# EAGLE design Sensact v4.2 (EAGLE 8.2.1)
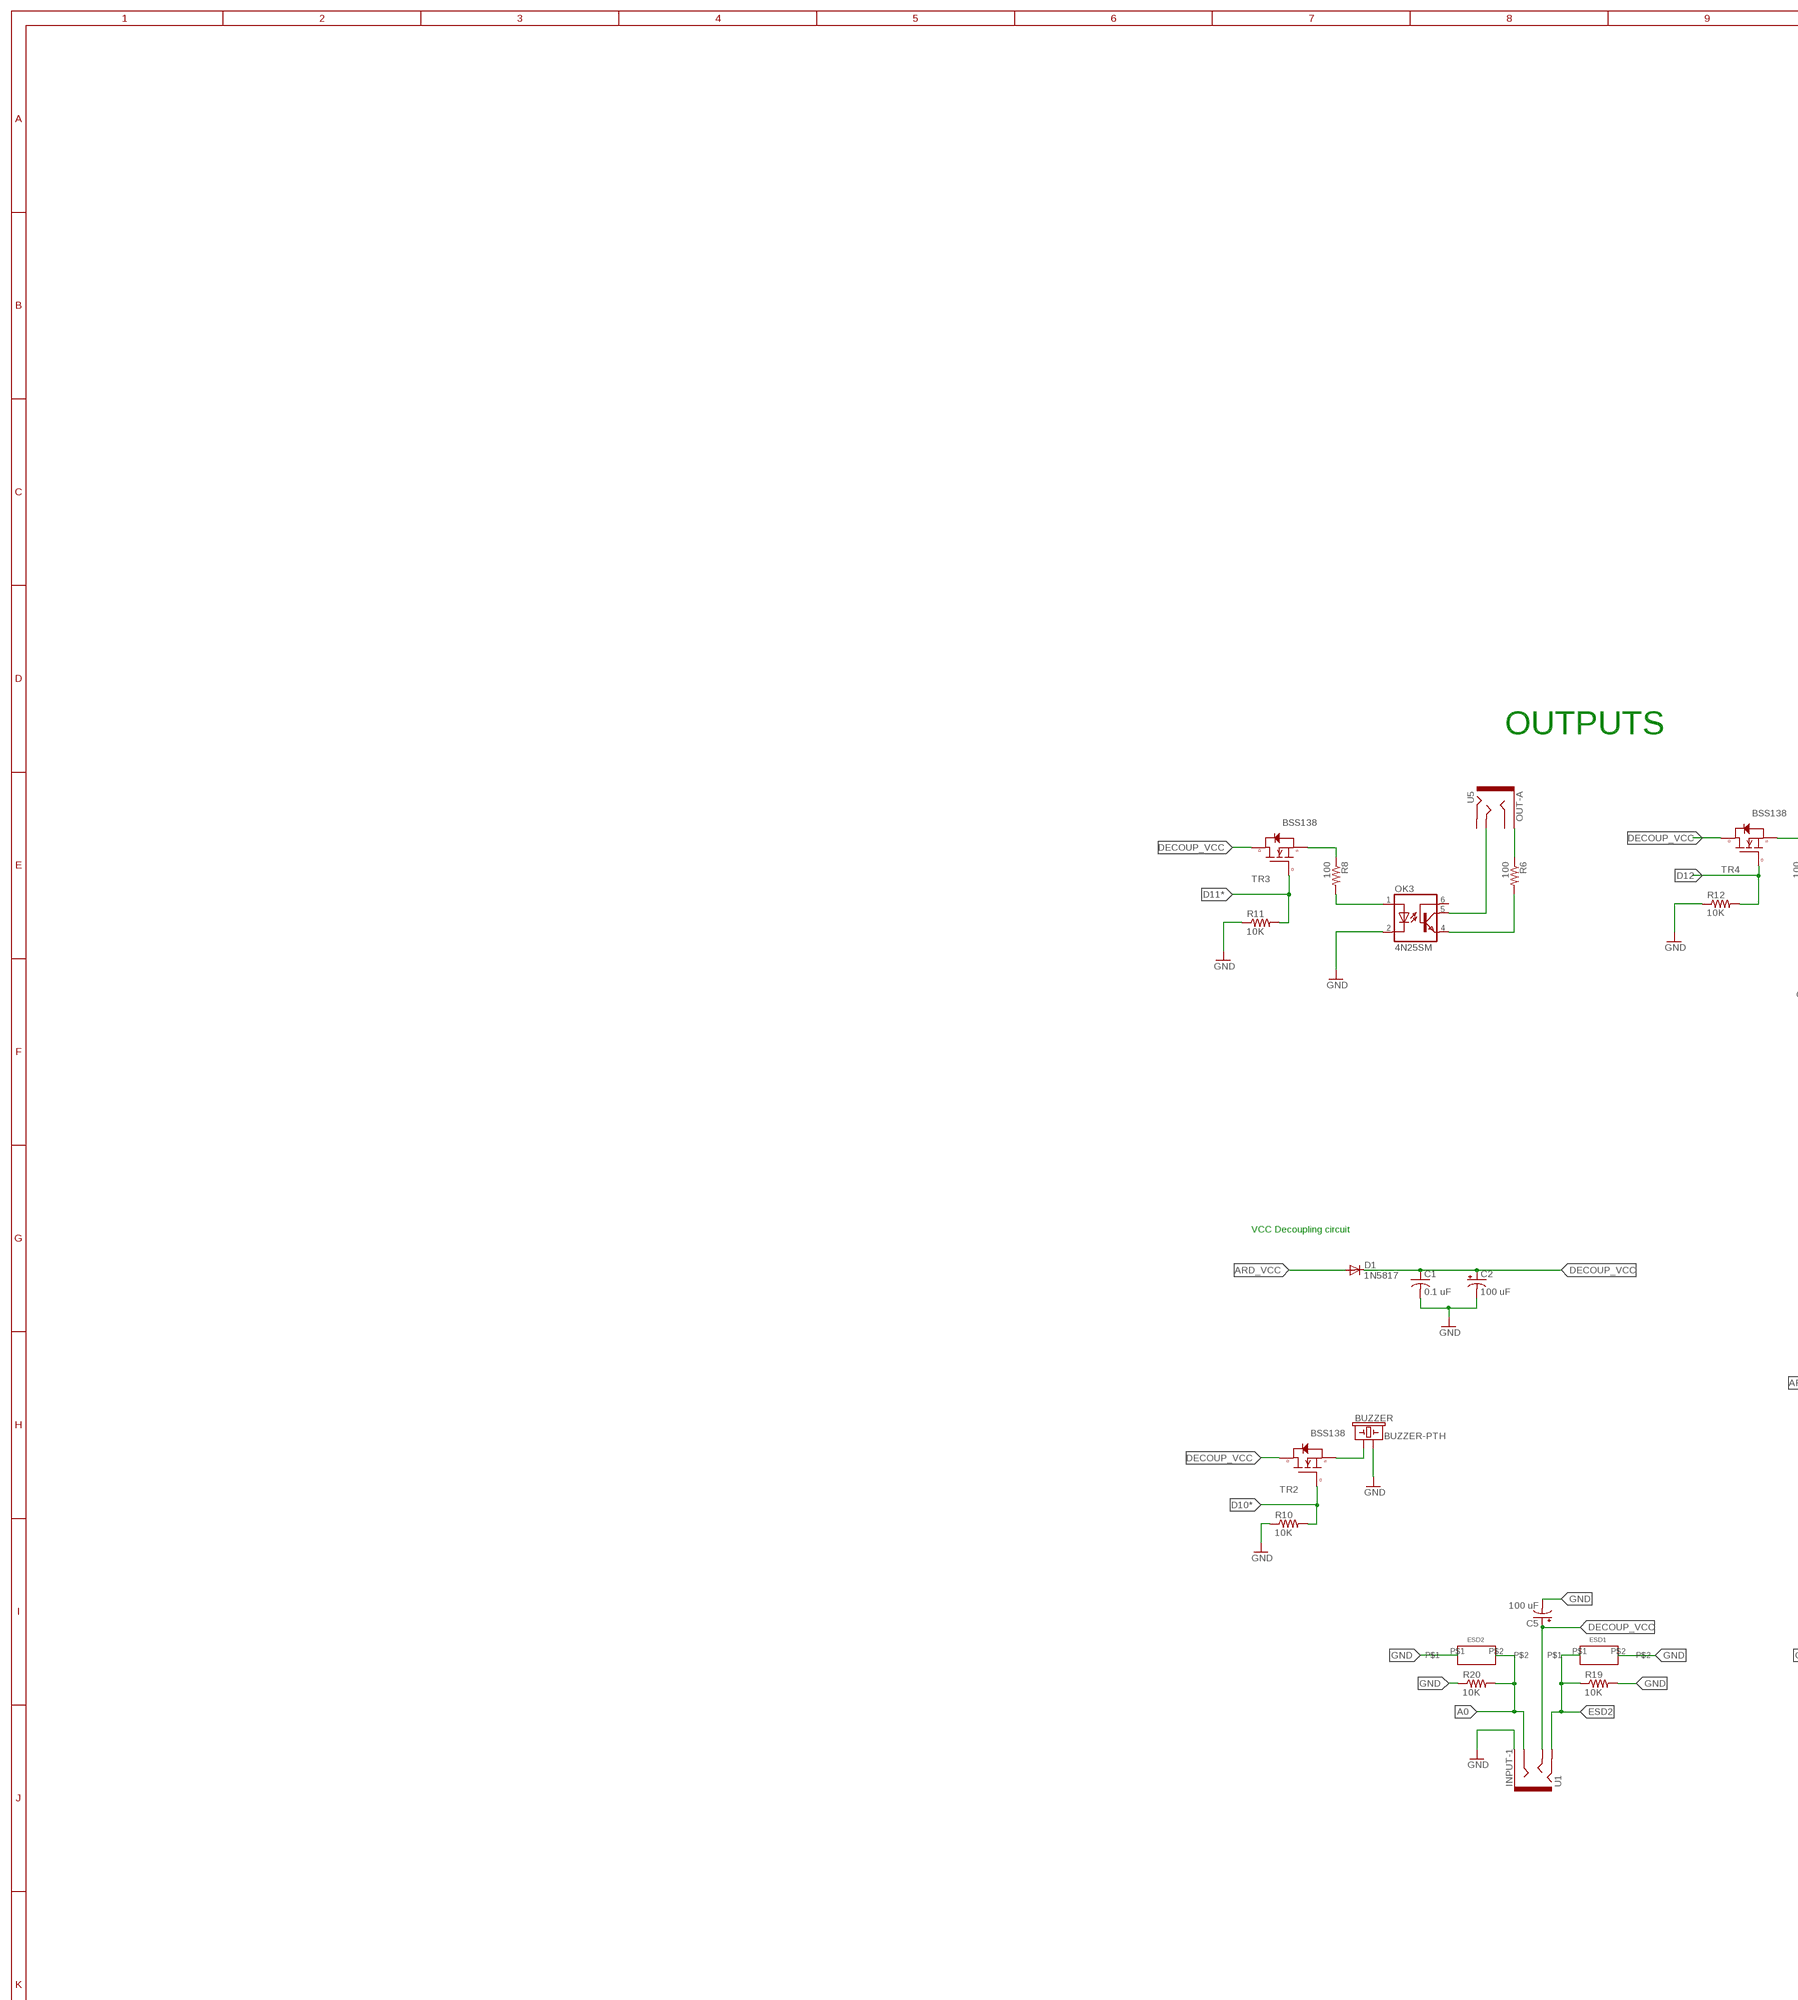
[diagram p0: schematic, sheet 1, part 1 of 3]
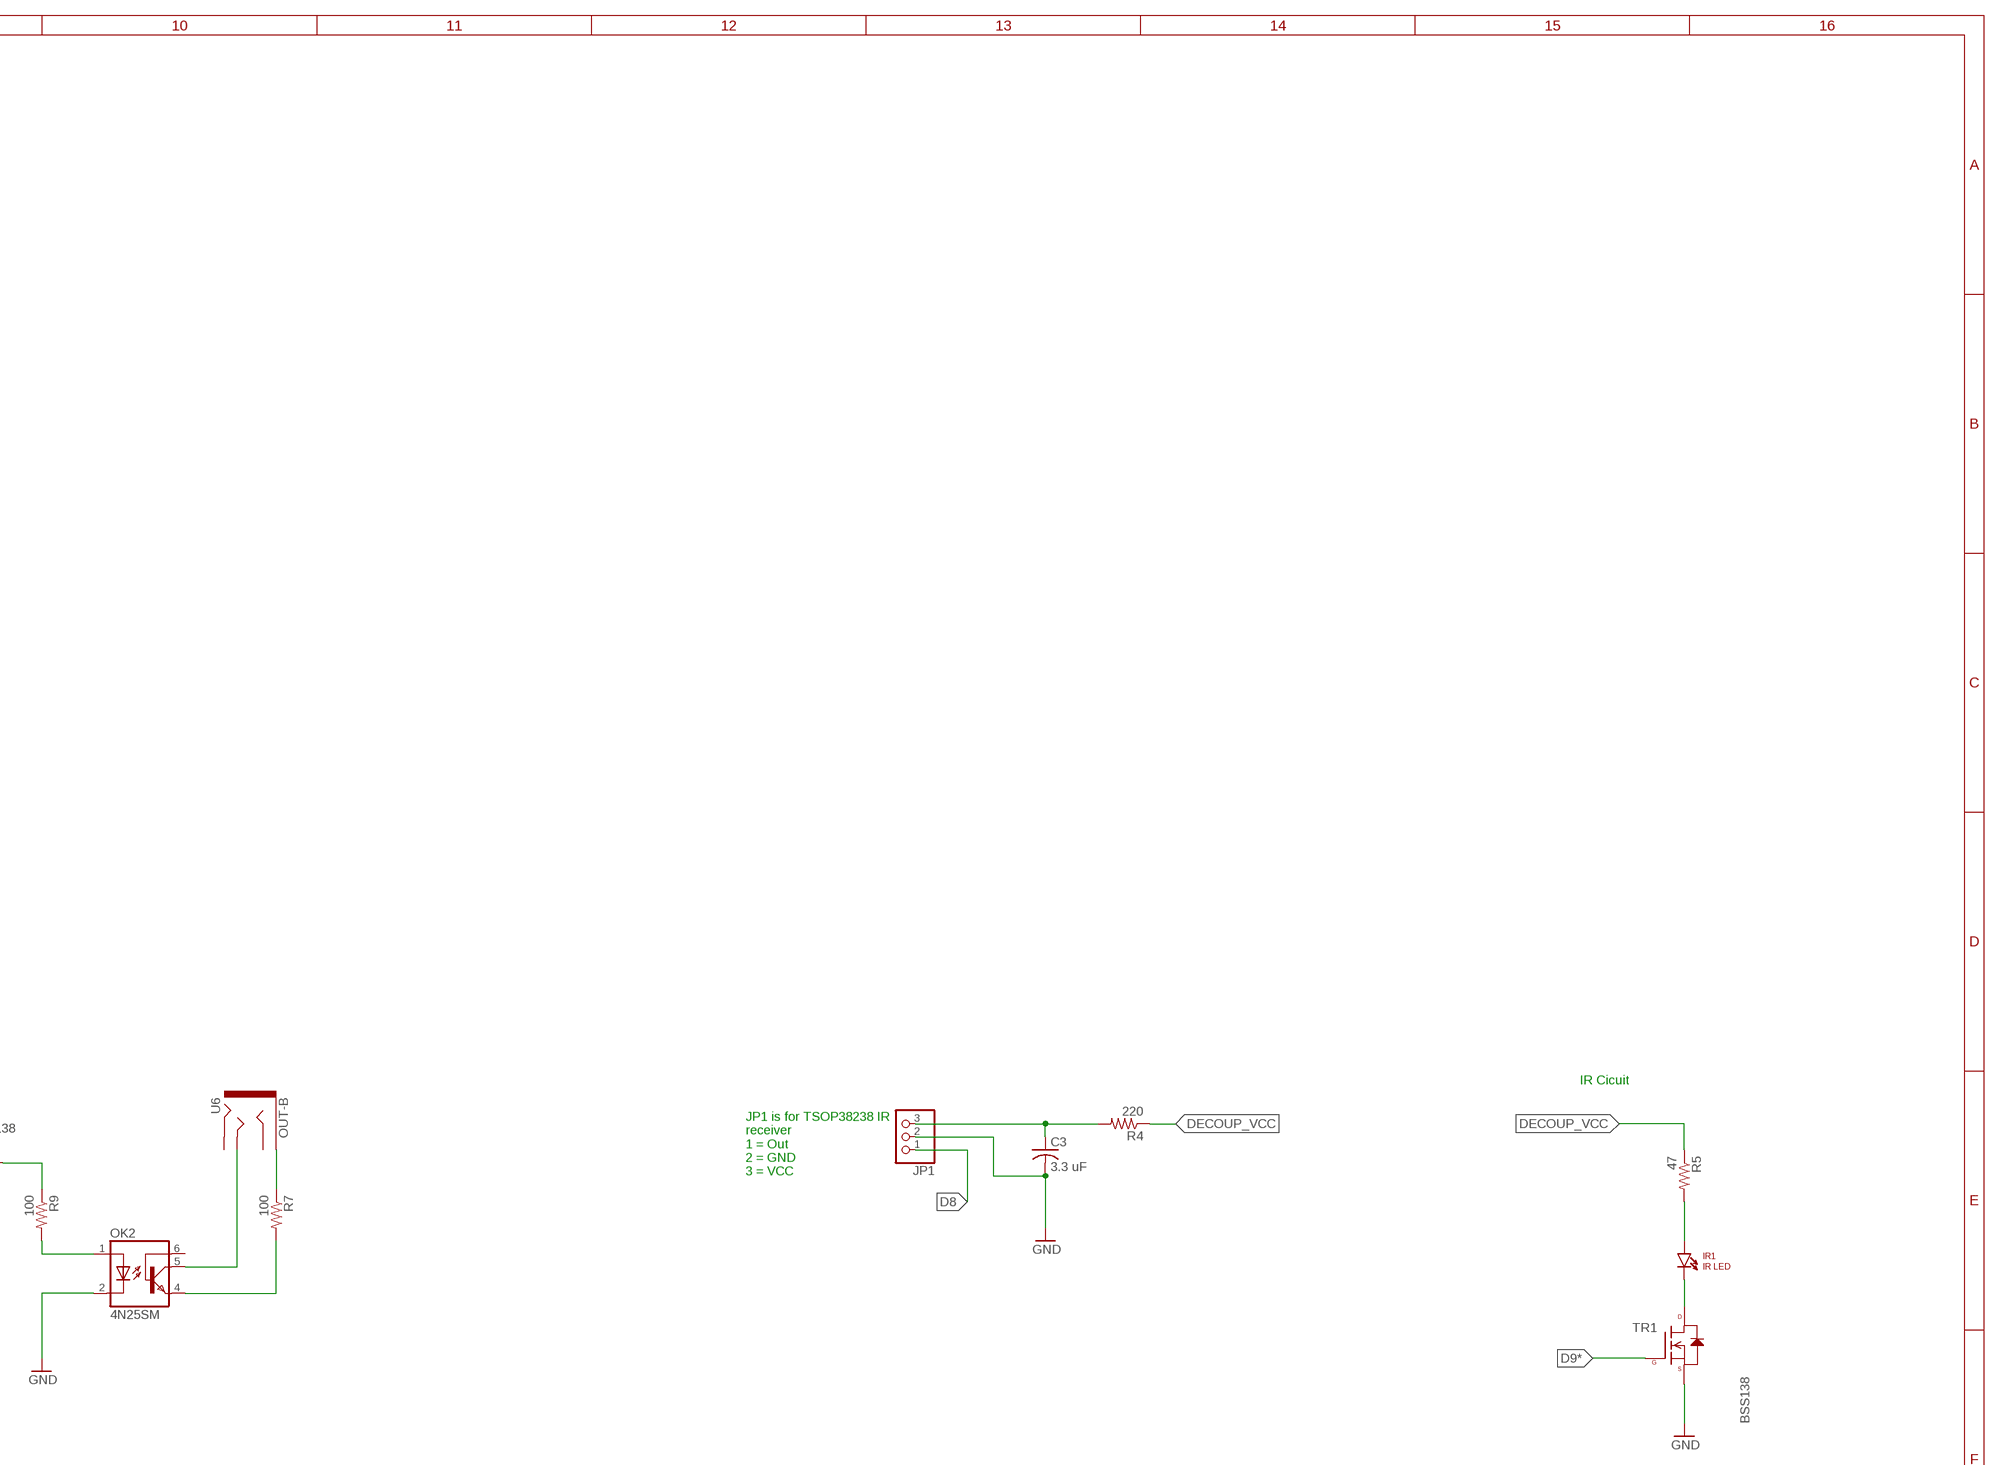
[diagram p1: schematic, sheet 1, part 2 of 3]
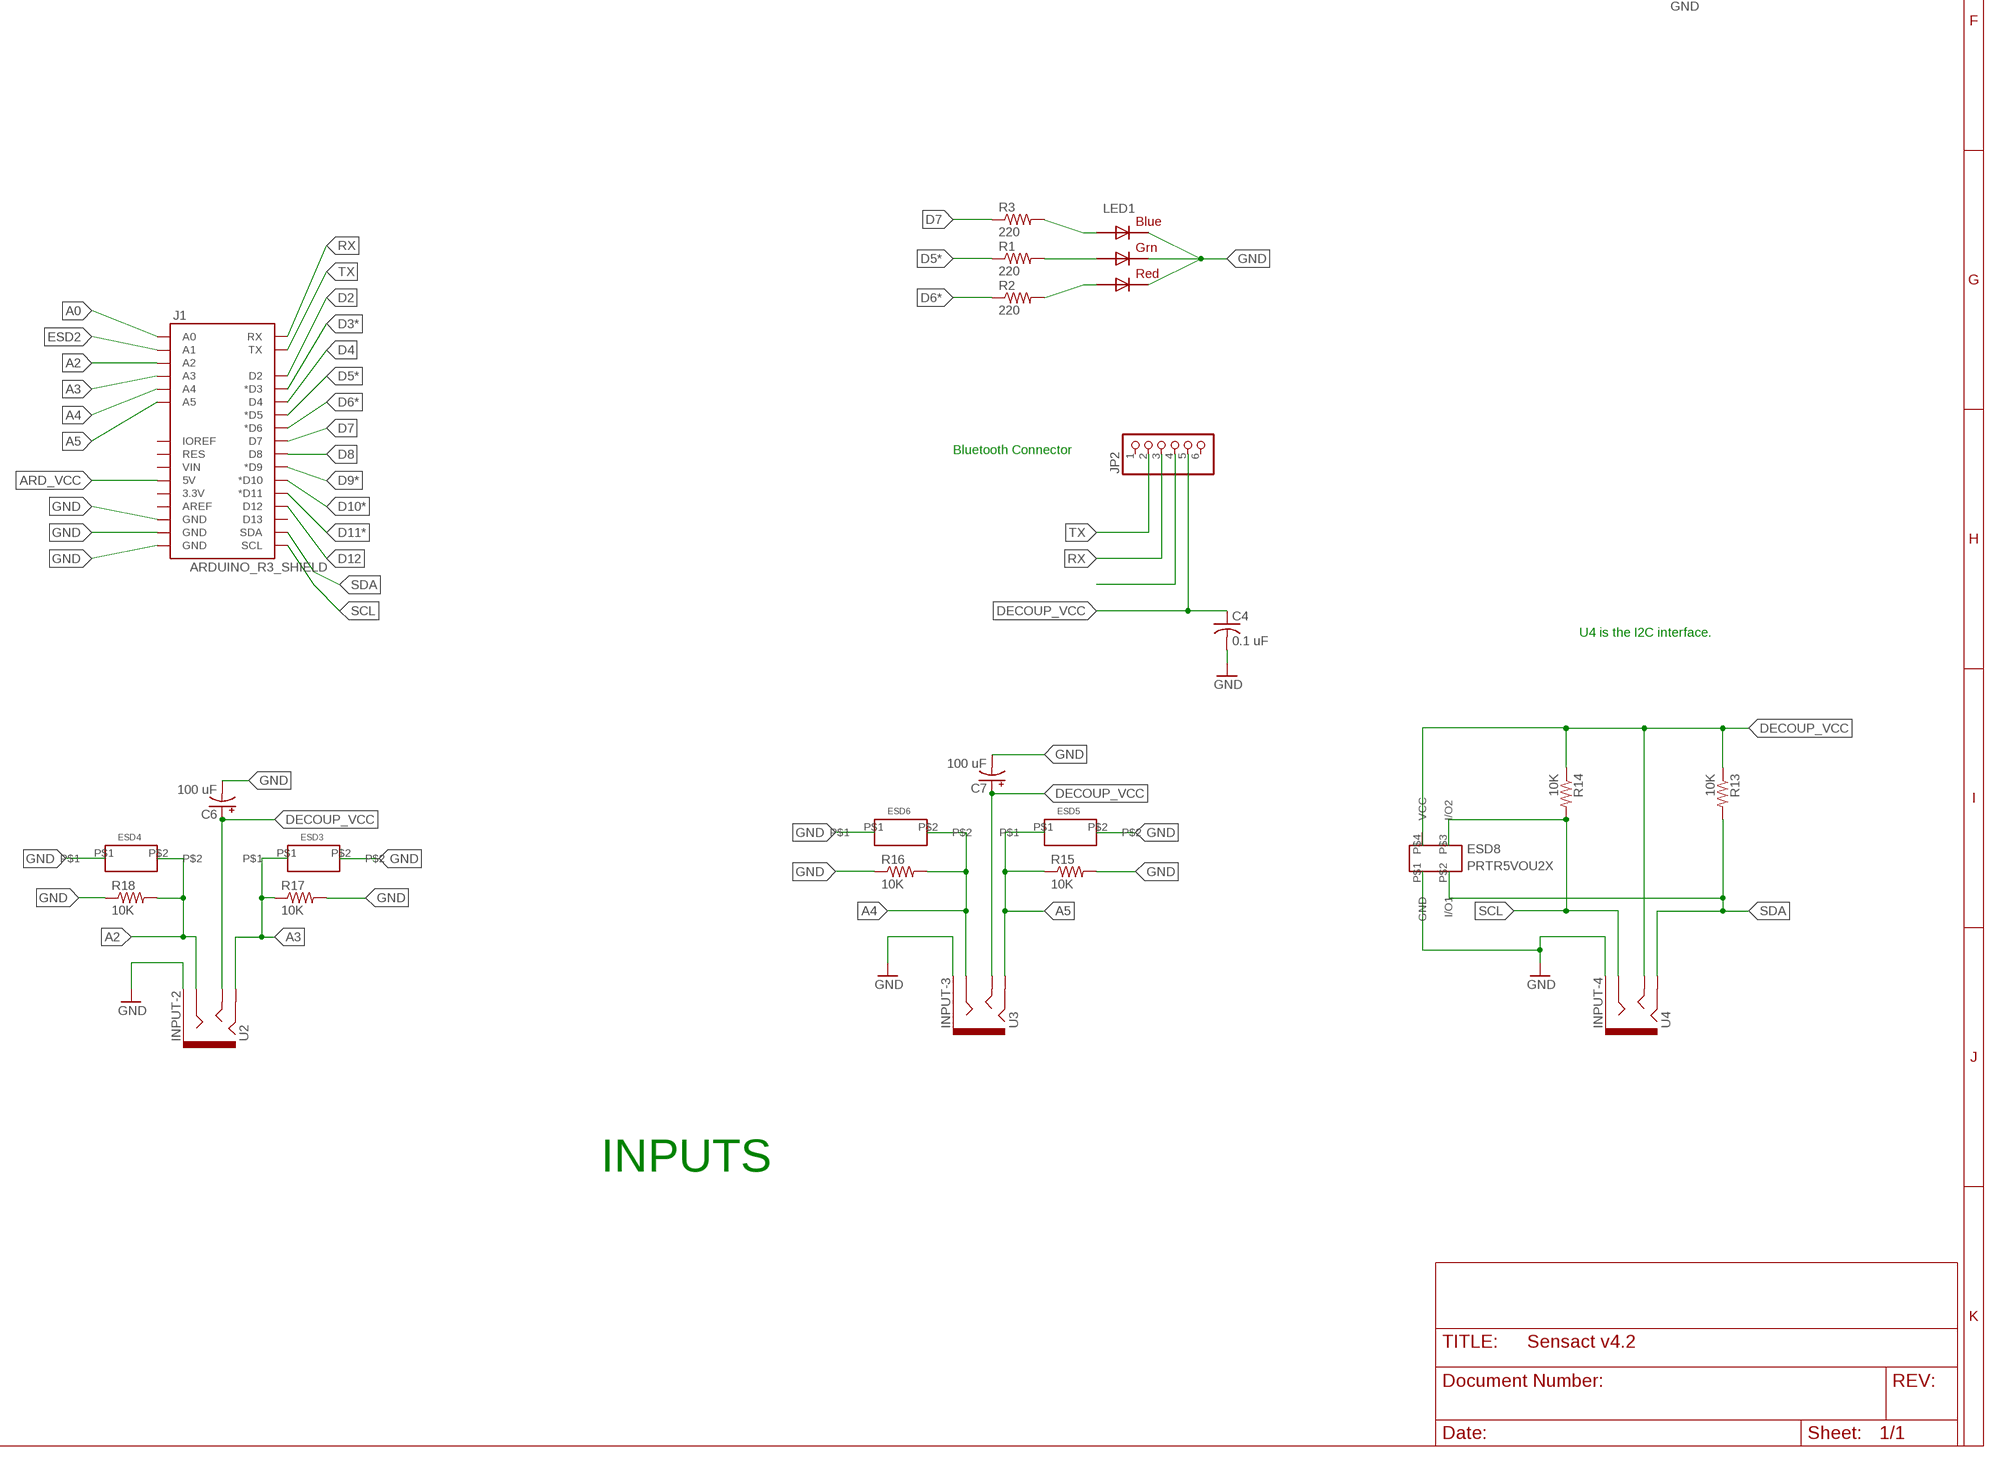
[diagram p2: schematic, sheet 1, part 3 of 3]

## Parts
BUZZER  BUZZER-PTH  [BUZZER-12MM]
C1  0.1 uF  C-USC0805  [C0805]
C2  100 uF  CAP_POLC  [PANASONIC_C]
C3  3.3 uF  C-USC0805  [C0805]
C4  0.1 uF  C-USC0805  [C0805]
C5  100 uF  CAP_POLC  [PANASONIC_C]
C6  100 uF  CAP_POLC  [PANASONIC_C]
C7  100 uF  CAP_POLC  [PANASONIC_C]
D1  1N5817  DIODE-DO214AC  [DO214AC]
ESD1  PESD5V0S1BA  [SOD323]
ESD2  PESD5V0S1BA  [SOD323]
ESD3  PESD5V0S1BA  [SOD323]
ESD4  PESD5V0S1BA  [SOD323]
ESD5  PESD5V0S1BA  [SOD323]
ESD6  PESD5V0S1BA  [SOD323]
ESD8  PRTR5VOU2X  [215]
INPUT-1  U1  AUDIO-JACK-TRRS-THRUHOLE  [AUDIO-JACK-TRRS-THRUHOLE]
INPUT-2  U2  AUDIO-JACK-TRRS-THRUHOLE  [AUDIO-JACK-TRRS-THRUHOLE]
INPUT-3  U3  AUDIO-JACK-TRRS-THRUHOLE  [AUDIO-JACK-TRRS-THRUHOLE]
INPUT-4  U4  AUDIO-JACK-TRRS-THRUHOLE  [AUDIO-JACK-TRRS-THRUHOLE]
IR1  IR LED  LTE-302  [LTE-302]
J1  ARDUINO_R3_SHIELD  [UNO_R3_SHIELD]
JP1  PINHD-1X3  [1X03]
JP2  PINHD-1X6  [1X06]
LED1  RGBLED5050  [RGBLED5050]
OK2  4N25SM  [DIL6-SMD]
OK3  4N25SM  [DIL6-SMD]
OUT-A  U5  AUDIO-JACK-TRRS-THRUHOLE  [AUDIO-JACK-TRRS-THRUHOLE]
OUT-B  U6  AUDIO-JACK-TRRS-THRUHOLE  [AUDIO-JACK-TRRS-THRUHOLE]
R1  220  RESISTOR0805-RES  [0805]
R2  220  RESISTOR0805-RES  [0805]
R3  220  RESISTOR0805-RES  [0805]
R4  220  RESISTOR0805-RES  [0805]
R5  47  RESISTOR0805-RES  [0805]
R6  100  RESISTOR0805-RES  [0805]
R7  100  RESISTOR0805-RES  [0805]
R8  100  RESISTOR0805-RES  [0805]
R9  100  RESISTOR0805-RES  [0805]
R10  10K  RESISTOR0805-RES  [0805]
R11  10K  RESISTOR0805-RES  [0805]
R12  10K  RESISTOR0805-RES  [0805]
R13  10K  RESISTOR0805-RES  [0805]
R14  10K  RESISTOR0805-RES  [0805]
R15  10K  RESISTOR0805-RES  [0805]
R16  10K  RESISTOR0805-RES  [0805]
R17  10K  RESISTOR0805-RES  [0805]
R18  10K  RESISTOR0805-RES  [0805]
R19  10K  RESISTOR0805-RES  [0805]
R20  10K  RESISTOR0805-RES  [0805]
TR1  BSS138  N-CHANNEL-MOSFET-BSS138  [SOT23-3]
TR2  BSS138  N-CHANNEL-MOSFET-BSS138  [SOT23-3]
TR3  BSS138  N-CHANNEL-MOSFET-BSS138  [SOT23-3]
TR4  BSS138  N-CHANNEL-MOSFET-BSS138  [SOT23-3]

## Nets
A0: ESD2.P$2 INPUT-1.RING1 J1.A0 R20.2
A2: ESD4.P$2 INPUT-2.RING1 J1.A2 R18.2
A3: ESD3.P$1 INPUT-2.RING2 J1.A3 R17.1
A4: ESD6.P$2 INPUT-3.RING1 J1.A4 R16.2
A5: ESD5.P$1 INPUT-3.RING2 J1.A5 R15.1
ARD_VCC: D1.A J1.5V
D2: J1.D2
D3*: J1.D3(*D3)
D4: J1.D4
D5*: J1.D5(*D5) R1.1
D6*: J1.D6(*D6) R2.1
D7: J1.D7 R3.1
D8: J1.D8 JP1.1
D9*: J1.D9(*D9) TR1.1(G)
D10*: J1.D10(*D10) R10.2 TR2.1(G)
D11*: J1.D11(*D11) R11.2 TR3.1(G)
D12: J1.D12 R12.2 TR4.1(G)
DECOUP_VCC: C1.1 C2.+ C4.1 C5.+ C6.+ C7.+ D1.C ESD8.P$4(VCC) INPUT-1.TIP INPUT-2.TIP INPUT-3.TIP INPUT-4.TIP JP2.5 R4.1 R5.1 R13.1 R14.1 TR2.3(D) TR3.3(D) TR4.3(D)
ESD2: ESD1.P$1 INPUT-1.RING2 J1.A1 R19.1
GND: BUZZER.- C1.2 C2.- C3.2 C4.2 ESD1.P$2 ESD2.P$1 ESD3.P$2 ESD4.P$1 ESD5.P$2 ESD6.P$1 ESD8.P$1(GND) INPUT-1.SLEEVE(EARTH) INPUT-2.SLEEVE(EARTH) INPUT-3.SLEEVE(EARTH) INPUT-4.SLEEVE(EARTH) J1.GND@0(GND) J1.GND@1(GND) J1.GND@2(GND) JP1.2 JP2.4 LED1.4(BLUE_C) LED1.5(RED_C) LED1.6(GREEN_C) OK2.2(C) OK3.2(C) R10.1 R11.1 R12.1 R15.2 R16.1 R17.2 R18.1 R19.2 R20.1 TR1.2(S)
N$1: C3.1 JP1.3 R4.2
N$2: OK3.4(EMI) R6.2
N$3: OK2.1(A) R9.2
N$4: OK3.1(A) R8.2
N$5: LED1.3(BLUE_A) R3.2
N$6: LED1.1(GREEN_A) R1.2
N$7: LED1.2(RED_A) R2.2
N$8: OK3.5(COL) OUT-A.TIP
N$9: OUT-A.SLEEVE(EARTH) R6.1
N$10: OK2.5(COL) OUT-B.TIP
N$11: OUT-B.SLEEVE(EARTH) R7.1
N$12: OK2.4(EMI) R7.2
N$13: IR1.A R5.2
N$14: IR1.C TR1.3(D)
N$15: BUZZER.+ TR2.2(S)
N$16: R9.1 TR4.2(S)
N$17: C5.-
N$18: C6.-
N$19: R8.1 TR3.2(S)
N$20: C7.-
RX: J1.RX JP2.3
SCL: ESD8.P$3(I/O2) INPUT-4.RING1 J1.SCL R14.2
SDA: ESD8.P$2(I/O1) INPUT-4.RING2 J1.SDA R13.2
TX: J1.TX JP2.2
Unconnected: J1.3.3V J1.AREF J1.D13 J1.IOREF J1.RES J1.VIN JP2.1 JP2.6 OK2.6(BAS) OK3.6(BAS) OUT-A.RING1 OUT-A.RING2 OUT-B.RING1 OUT-B.RING2

## Notes on the sheet
- OUTPUTS
- IR Cicuit
- JP1 is for TSOP38238 IR
  receiver
  1 = Out
  2 = GND
  3 = VCC
- VCC Decoupling circuit
- Bluetooth Connector
- U4 is the I2C interface.
- INPUTS

## Library data of the parts
BUZZER = SparkFun-Electromechanical:BUZZER: Buzzer Small round buzzers that operate around the audible 2kHz range. You can use these as speakers to create simple music or user interfaces. Variant Overview: PTH - Mini Speaker - PC Mount 12mm 2.048kHz <https://www.sparkfun.com/products/7950> PTH_KIT - Mini Speaker - PC Mount 12mm 2.048kHz <https://www.sparkfun.com/products/7950> KIT simplifies soldering by adding stop mask to one side of the pads. PTH_NO_SILK - Mini Speaker - PC Mount 12mm 2.048kHz <https://www.sparkfun.com/products/7950> No silkscreen indicator of buzzer outline. PTH_KIT_NO_SILK - Mini Speaker - PC Mount 12mm 2.048kHz <https://www.sparkfun.com/products/7950> KIT package w/o silkscreen SMD - Buzzer Audio Magnetic (CCV-084B16) SMD buzzer used on, e.g. the LilyPad Buzzer <https://www.sparkfun.com/products/8463> and RFID USB Reader <https://www.sparkfun.com/products/9963>. SMD_KIT - Buzzer Audio Magnetic (CCV-084B16) SMD Buzzer with elongated pins to make soldering easier. Used on the SparkFun Simon Says - Surface Mount Soldering Kit <https://www.sparkfun.com/products/10935>.; PROD_ID: COMP-08253; SF_SKU: COM-07950
C1 C3 C4 = adafruit:C-US: CAPACITOR, American symbol
C2 C5-C7 = SparkFun-Capacitors:CAP_POL: Capacitor Polarized These are standard SMD and PTH capacitors. Normally 10uF, 47uF, and 100uF in electrolytic and tantalum varieties. Always verify the external diameter of the through hole cap, it varies with capacity, voltage, and manufacturer. The EIA devices should be standard.
D1 = diode:DIODE-: DIODE
ESD1-ESD6 = sdp:PESD5V0S1BA: ESD protection diode
ESD8 = sdp:PRTR5VOU2X: ESD Protection for I2C lines.
INPUT-1-INPUT-4 OUT-A OUT-B = bruce_library:AUDIO-JACK-TRRS-THRUHOLE
IR1 = SparkFun-LED:LTE-302: Through-hole side-firing 940nm IR LED
J1 = SparkFun-Boards:ARDUINO_R3_SHIELD: Shield form compatible with the Arduino Uno R3.
JP1 = adafruit:PINHD-1X3: PIN HEADER
JP2 = adafruit:PINHD-1X6: PIN HEADER
LED1 = adafruit:RGBLED: For 5050 RGB LEDs, the order of the LEDs may vary from one manufacturer to another!
OK2 OK3 = optocoupler:4N*?M: General Purpose 6-Pin Phototransistor Optocouplers Source: http://www.fairchildsemi.com/ds/4N/4N35-M.pdf; MF: FAIRCHILD SEMICONDUCTOR; MPN: 4N25SM; OC_FARNELL: 1021152; OC_NEWARK: 34C2020
R1-R20 = SparkFun-Passives:RESISTOR: Resistor Basic schematic elements and footprints for 0603, 1206, and PTH resistors.
TR1-TR4 = GeekAmmo:N-CHANNEL-MOSFET: N-Channel MOSFET Mode Field Effect Transistor; DATASHEET: http://www.fairchildsemi.com/ds/BS/BSS138.pdf; DIGIKEY: BSS138TR-ND; ELEMENT14: 2323154; URL: http://au.element14.com/fairchild-semiconductor/bss138/mosfet-n-ch-50v-220ma-sot-23/dp/2323154

## Net classes
0 default: width 0.305 mm, drill 0.508 mm, clearance 0.254 mm

## Board
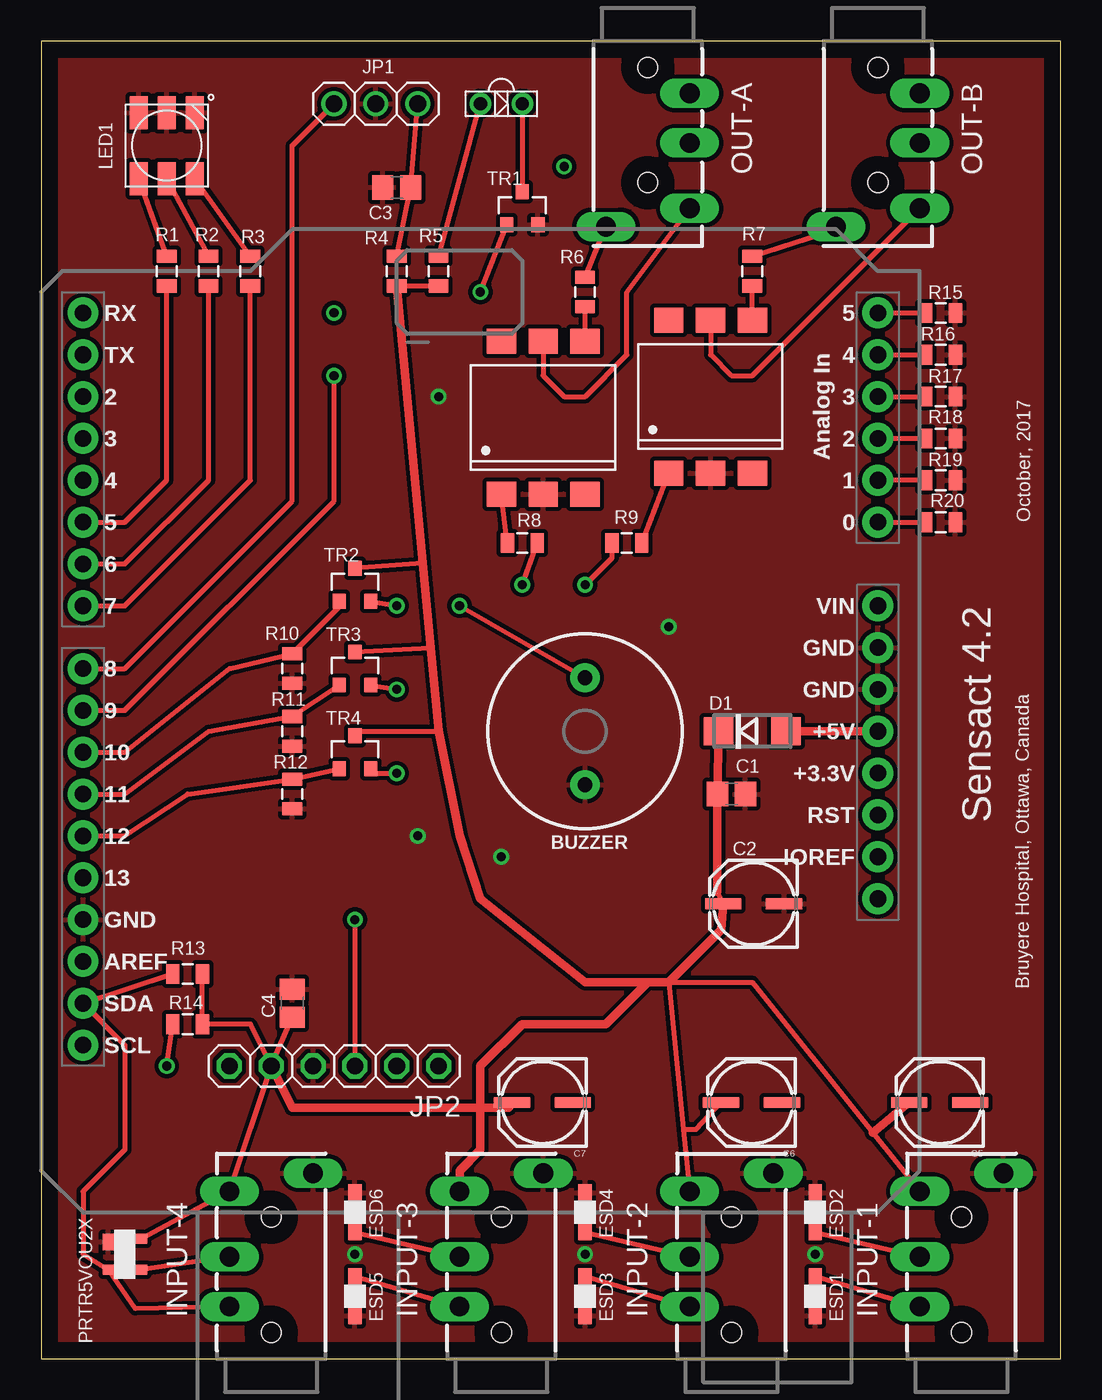
[diagram p3: board, top side]
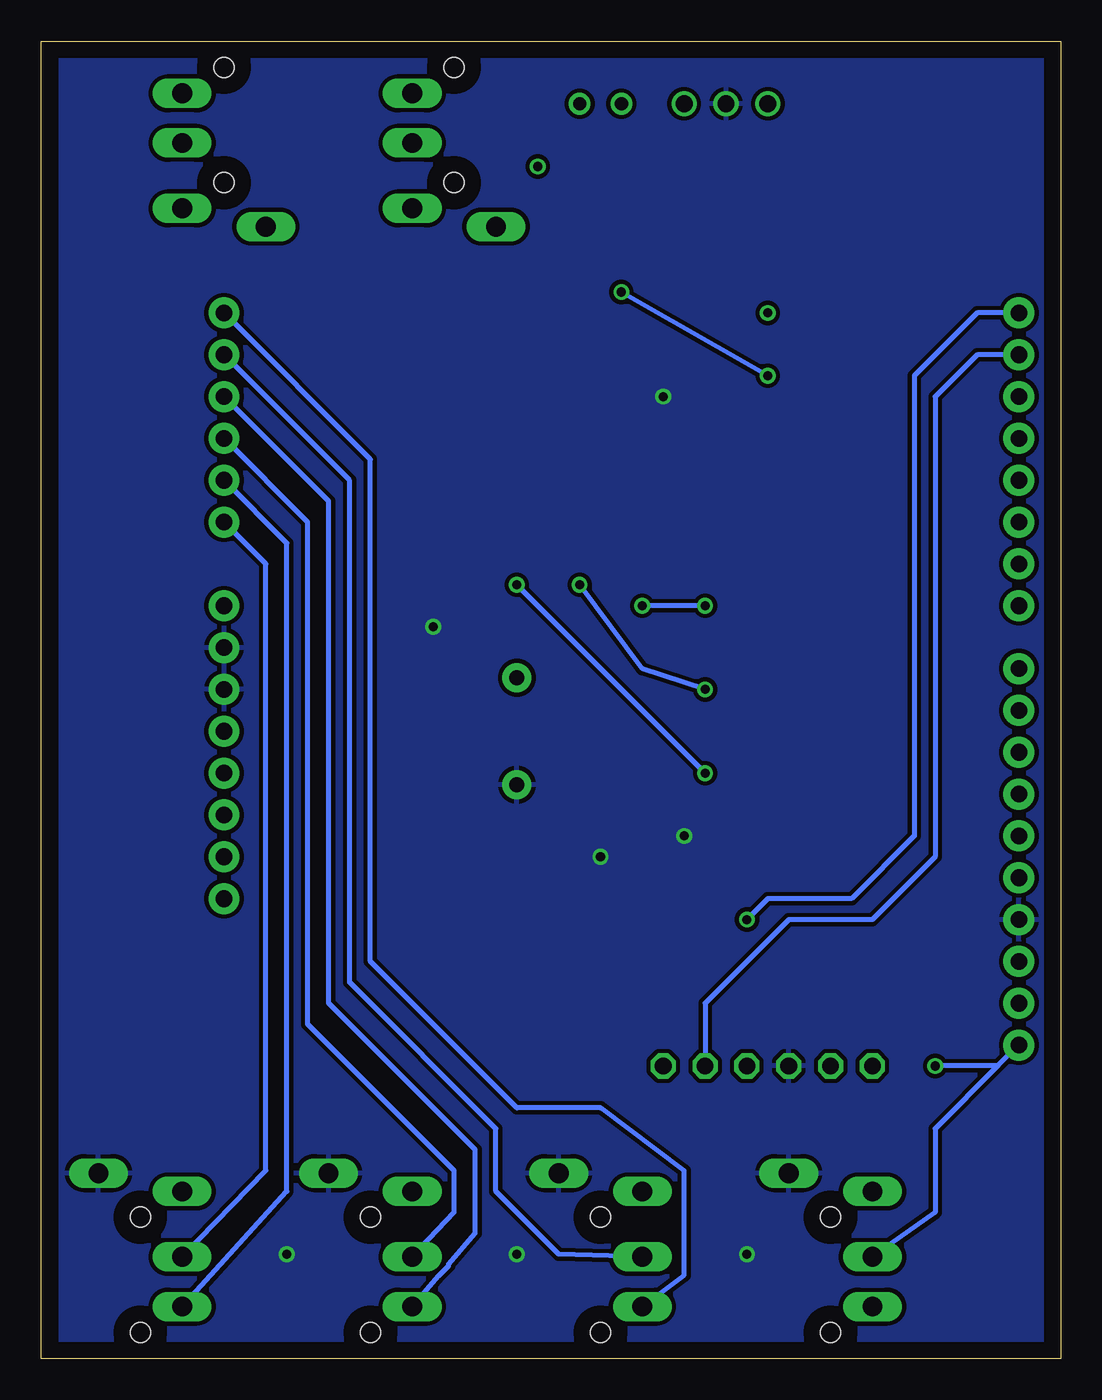
[diagram p4: board, bottom side, seen from below]

Size 61.9 x 80 mm. Coordinates in mm from the lower left corner, seen from the top.
Outline: 0,0 61.9,0 61.9,80 0,80 0,0
Copper layers (1*16): Top 0.035mm / dielectric 1.5mm / Bottom 0.035mm
Design rules "default": minimum track width 6mil, minimum drill 0.35mm, track to track 6mil, track to pad 6mil, pad to pad 6mil, via to via 6mil, smd to smd 6mil, copper to edge 40mil, drill to drill 6mil, minimum pad ring 10mil, minimum via ring 8mil, stop-mask expansion 4mil, vias tented up to drill 0mil, thermal gap 10mil

### Footprints (pad centres in the part's own frame; a part is rotated, then mirrored left to right if it is on the bottom)
BUZZER-12MM = drill 0.9 pad 1.778: + 3.25,0; - -3.25,0
C0805 = smd 1.3 x 1.5: 1 -0.85,0; 2 0.85,0
PANASONIC_C = smd 2.2 x 0.65: + 1.9,-0.2; - -1.8,-0.2
DO214AC = smd 1.8 x 1.7: A 2.05,0; C -2.05,0
SOD323 = smd 1 x 0.8: P$1 -1.2,0; P$2 1.2,0
215 = smd 1 x 0.7: P$1 -0.75,-1 | smd 0.6 x 0.7: P$2 0.95,-1; P$3 0.95,1; P$4 -0.95,1
AUDIO-JACK-TRRS-THRUHOLE = drill 1.2 long: RING1 6.191,2.54; RING2 3.175,2.54; SLEEVE 11.271,-2.54; TIP 10.16,2.54 | hole 1.2: 1.6,0; 8.6,0
LTE-302 = drill 0.8: A 1.27,0; C -1.27,0
UNO_R3_SHIELD = drill 1.016 pad 1.88: 3.3V 50.8,26.67; 5V 50.8,29.21; A0 50.8,41.91; A1 50.8,44.45; A2 50.8,46.99; A3 50.8,49.53; A4 50.8,52.07; A5 50.8,54.61; AREF 2.54,15.24; D2 2.54,49.53; D3 2.54,46.99; D4 2.54,44.45; D5 2.54,41.91; D6 2.54,39.37; D7 2.54,36.83; D8 2.54,33.02; D9 2.54,30.48; D10 2.54,27.94; D11 2.54,25.4; D12 2.54,22.86; D13 2.54,20.32; GND@0 50.8,31.75; GND@1 50.8,34.29; GND@2 2.54,17.78; IOREF 50.8,21.59; NC 50.8,19.05; RES 50.8,24.13; RX 2.54,54.61; SCL 2.54,10.16; SDA 2.54,12.7; TX 2.54,52.07; VIN 50.8,36.83
1X03 = drill 1.016: 1 -2.54,0; 2 0,0; 3 2.54,0
1X06 = drill 1.016 octagon: 1 -6.35,0; 2 -3.81,0; 3 -1.27,0; 4 1.27,0; 5 3.81,0; 6 6.35,0
RGBLED5050 = smd 2 x 1.1: 1 -2,1.7; 2 -2,0; 3 -2,-1.7; 4 2,-1.7; 5 2,0; 6 2,1.7
DIL6-SMD = smd 1.78 x 1.52: 1 -2.54,-4.645; 2 0,-4.645; 3 2.54,-4.645; 4 2.54,4.645; 5 0,4.645; 6 -2.54,4.645
0805 = smd 0.8 x 1.2: 1 -0.9,0; 2 0.9,0
SOT23-3 = smd 0.8 x 0.9: 1 -0.95,-1; 2 0.95,-1; 3 0,1

### Placement (x,y rotation side)
BUZZER  33.02,38.1 90 top
C1  41.91,34.29 0 top
C2  43.31,27.43 180 top
C3  21.59,71.12 180 top
C4  15.24,21.59 90 top
C5  54.61,15.37 180 top
C6  43.18,15.37 180 top
C7  30.48,15.37 180 top
D1  43.18,38.1 0 top
ESD1  46.99,3.81 270 top
ESD2  46.99,8.89 270 top
ESD3  33.02,3.81 270 top
ESD4  33.02,8.89 270 top
ESD5  19.05,3.81 270 top
ESD6  19.05,8.89 270 top
ESD8  5.08,6.35 270 top
INPUT-1  55.88,0 90 top
INPUT-2  41.91,0 90 top
INPUT-3  27.94,0 90 top
INPUT-4  13.97,0 90 top
IR1  27.94,76.2 180 top
J1  0,8.89 0 top
JP1  20.32,76.2 0 top
JP2  17.78,17.78 180 top
LED1  7.62,73.66 90 top
OK2  40.64,58.42 0 top
OK3  30.48,57.15 0 top
OUT-A  36.83,80.01 270 top
OUT-B  50.8,80.01 270 top
R1  7.62,66.04 90 top
R2  10.16,66.04 90 top
R3  12.7,66.04 90 top
R4  21.59,66.04 90 top
R5  24.13,66.04 90 top
R6  33.02,64.77 270 top
R7  43.18,66.04 270 top
R8  29.21,49.53 180 top
R9  35.56,49.53 0 top
R10  15.24,41.91 90 top
R11  15.24,38.1 90 top
R12  15.24,34.29 90 top
R13  8.89,23.37 180 top
R14  8.89,20.32 180 top
R15  54.61,63.5 0 top
R16  54.61,60.96 180 top
R17  54.61,58.42 0 top
R18  54.61,55.88 180 top
R19  54.61,53.34 0 top
R20  54.61,50.8 180 top
TR1  29.21,69.85 0 top
TR2  19.05,46.99 0 top
TR3  19.05,41.91 0 top
TR4  19.05,36.83 0 top

### Tracks (layer width: path | path; a pad name or v marks a point on that pad's centre or on a via)
A0
  Top 0.305: J1.A0 R20.2 | ESD2.P$2 INPUT-1.RING1
  Bottom 0.305: INPUT-1.RING1 48.26,11.43 48.26,48.26 J1.A0
A2
  Top 0.305: ESD4.P$2 INPUT-2.RING1 | J1.A2 R18.2
  Bottom 0.305: INPUT-2.RING1 36.83,8.89 36.83,11.43 45.72,20.32 45.72,50.8 J1.A2
A3
  Top 0.305: J1.A3 R17.1 | ESD3.P$1 INPUT-2.RING2
  Bottom 0.305: INPUT-2.RING2 37.76,5.06 37.16,5.65 37.16,5.75 35.56,7.62 35.56,12.7 44.45,21.59 44.45,52.07 J1.A3
A4
  Top 0.305: J1.A4 R16.2 | ESD6.P$2 INPUT-3.RING1
  Bottom 0.305: J1.A4 43.18,53.34 43.18,22.86 34.29,13.97 34.29,10.16 30.48,6.35 INPUT-3.RING1
A5
  Top 0.305: ESD5.P$1 INPUT-3.RING2 | J1.A5 R15.1
  Bottom 0.305: INPUT-3.RING2 22.86,5.08 22.86,11.43 27.94,15.24 33.02,15.24 41.91,24.13 41.91,54.61 J1.A5
ARD_VCC
  Top 0.508: J1.5V D1.A
D5*
  Top 0.305: J1.D5 5.08,50.8 7.62,53.34 R1.1
D6*
  Top 0.305: J1.D6 5.08,48.26 10.16,53.34 R2.1
D7
  Top 0.305: J1.D7 5.08,45.72 12.7,53.34 R3.1
D8
  Top 0.305: J1.D8 5.08,41.91 15.24,52.07 15.24,73.66 JP1.1
D9*  (via drill 0.55)
  Top 0.305: v26.67,64.77 TR1.1 | J1.D9 5.08,39.37 17.78,52.07 v17.78,59.69
  Bottom 0.305: v17.78,59.69 v26.67,64.77
D10*
  Top 0.305: TR2.1 18.1,45.67 R10.2 11.43,41.91 5.08,36.83 J1.D10
D11*
  Top 0.305: TR3.1 R11.2 10.16,38.1 5.08,34.29 J1.D11
D12
  Top 0.305: TR4.1 R12.2 8.89,34.29 5.08,31.75 J1.D12
DECOUP_VCC
  Top 0.305: 41.06,28.36 C2.+ | 38.99,13.93 38.1,22.86 43.18,22.86 50.49,13.72 INPUT-1.TIP | 38.99,13.93 INPUT-2.TIP | R4.1 R5.1 | R13.1 R14.1 12.7,20.32 JP2.5 | TR4.3 19.32,38.1 24.13,38.1 | ESD8.P$4 INPUT-4.TIP JP2.5 | JP2.5 C4.1 | 23.17,48.29 TR2.3 | 23.66,43.14 TR3.3 | 38.99,13.93 39.77,13.93 C6.+
  Top 0.508: 41.06,28.36 C1.1 D1.C | C2.+ 41.28,26.04 38.1,22.86 36.83,22.86 | 36.83,22.86 33.02,22.86 26.67,27.94 25.4,31.75 24.13,38.1 23.66,43.14 23.17,48.29 R4.1 | 36.83,22.86 34.29,20.32 29.21,20.32 26.67,17.78 26.67,15.24 | 26.67,15.24 26.67,12.7 25.4,11.43 INPUT-3.TIP | 26.67,15.24 28.38,15.24 C7.+ | 26.67,15.24 15.24,15.24 JP2.5 | 50.49,13.72 C5.+
ESD2
  Top 0.305: R19.1 J1.A1 | ESD1.P$1 INPUT-1.RING2
  Bottom 0.305: INPUT-1.RING2 46.99,10.16 46.99,49.53 J1.A1
GND  (via drill 0.55)
  other vias: 38.1,44.45 24.13,58.42 19.05,6.35 22.86,31.75 27.94,30.48 33.02,6.35 46.99,6.35
  pour Top: -1.27,81.28 -1.27,0 60.96,0 60.96,81.28
  pour Bottom: -1.27,81.28 -1.27,0 60.96,0 60.96,81.28
N$1
  Top 0.305: R4.2 C3.1 JP1.3
N$2
  Top 0.305: OK3.4 R6.2
N$3
  Top 0.305: R9.2 OK2.1
N$4
  Top 0.305: R8.2 OK3.1
N$5
  Top 0.305: R3.2 LED1.3
N$6
  Top 0.305: R1.2 LED1.1
N$7
  Top 0.305: R2.2 LED1.2
N$8
  Top 0.305: OK3.5 30.48,59.69 31.75,58.42 33.02,58.42 35.56,60.96 35.56,64.77 OUT-A.TIP
N$9
  Top 0.305: R6.1 OUT-A.SLEEVE
N$10
  Top 0.305: OK2.5 40.64,60.96 41.91,59.69 43.18,59.69 OUT-B.TIP
N$11
  Top 0.305: R7.1 48.26,68.58 46.99,68.58 OUT-B.SLEEVE
N$12
  Top 0.305: OK2.4 R7.2
N$13
  Top 0.305: R5.2 IR1.A
N$14
  Top 0.305: IR1.C TR1.3
N$15  (via drill 0.55)
  Top 0.305: TR2.2 v21.59,45.72 | v25.4,45.72 BUZZER.+
  Bottom 0.305: v21.59,45.72 v25.4,45.72
N$16  (via drill 0.55)
  Top 0.305: TR4.2 20.27,35.56 v21.59,35.56 | v33.02,46.99 34.66,48.63 R9.1
  Bottom 0.305: v21.59,35.56 v33.02,46.99
N$19  (via drill 0.55)
  Top 0.305: TR3.2 v21.59,40.64 | v29.21,46.99 R8.1
  Bottom 0.305: v21.59,40.64 25.4,41.91 v29.21,46.99
N$21  (via drill 0.55)
  other vias: 31.75,72.39
N$24  (via drill 0.55)
  other vias: 17.78,63.5
RX  (via drill 0.55)
  Top 0.305: v19.05,26.67 JP2.3
  Bottom 0.305: J1.RX 5.08,63.5 8.89,59.69 8.89,31.75 12.7,27.94 17.78,27.94 v19.05,26.67
SCL  (via drill 0.55)
  Top 0.305: INPUT-4.RING1 ESD8.P$3 | v7.62,17.78 R14.2
  Bottom 0.305: J1.SCL 3.81,17.78 | 3.81,17.78 7.62,13.97 7.62,8.89 INPUT-4.RING1 | 3.81,17.78 v7.62,17.78
SDA
  Top 0.305: INPUT-4.RING2 5.71,3.05 ESD8.P$2 2.54,6.35 2.54,10.16 5.08,12.7 5.08,19.05 J1.SDA R13.2
TX
  Bottom 0.305: J1.TX 5.08,60.96 7.62,58.42 7.62,30.48 11.43,26.67 16.51,26.67 21.59,21.59 JP2.2

### Text on the board
tNames: October, 2017 | Sensact 4.2 | Bruyere Hospital, Ottawa, Canada